# EAGLE schematic AquaLEd-drivers (EAGLE 8.4.1)
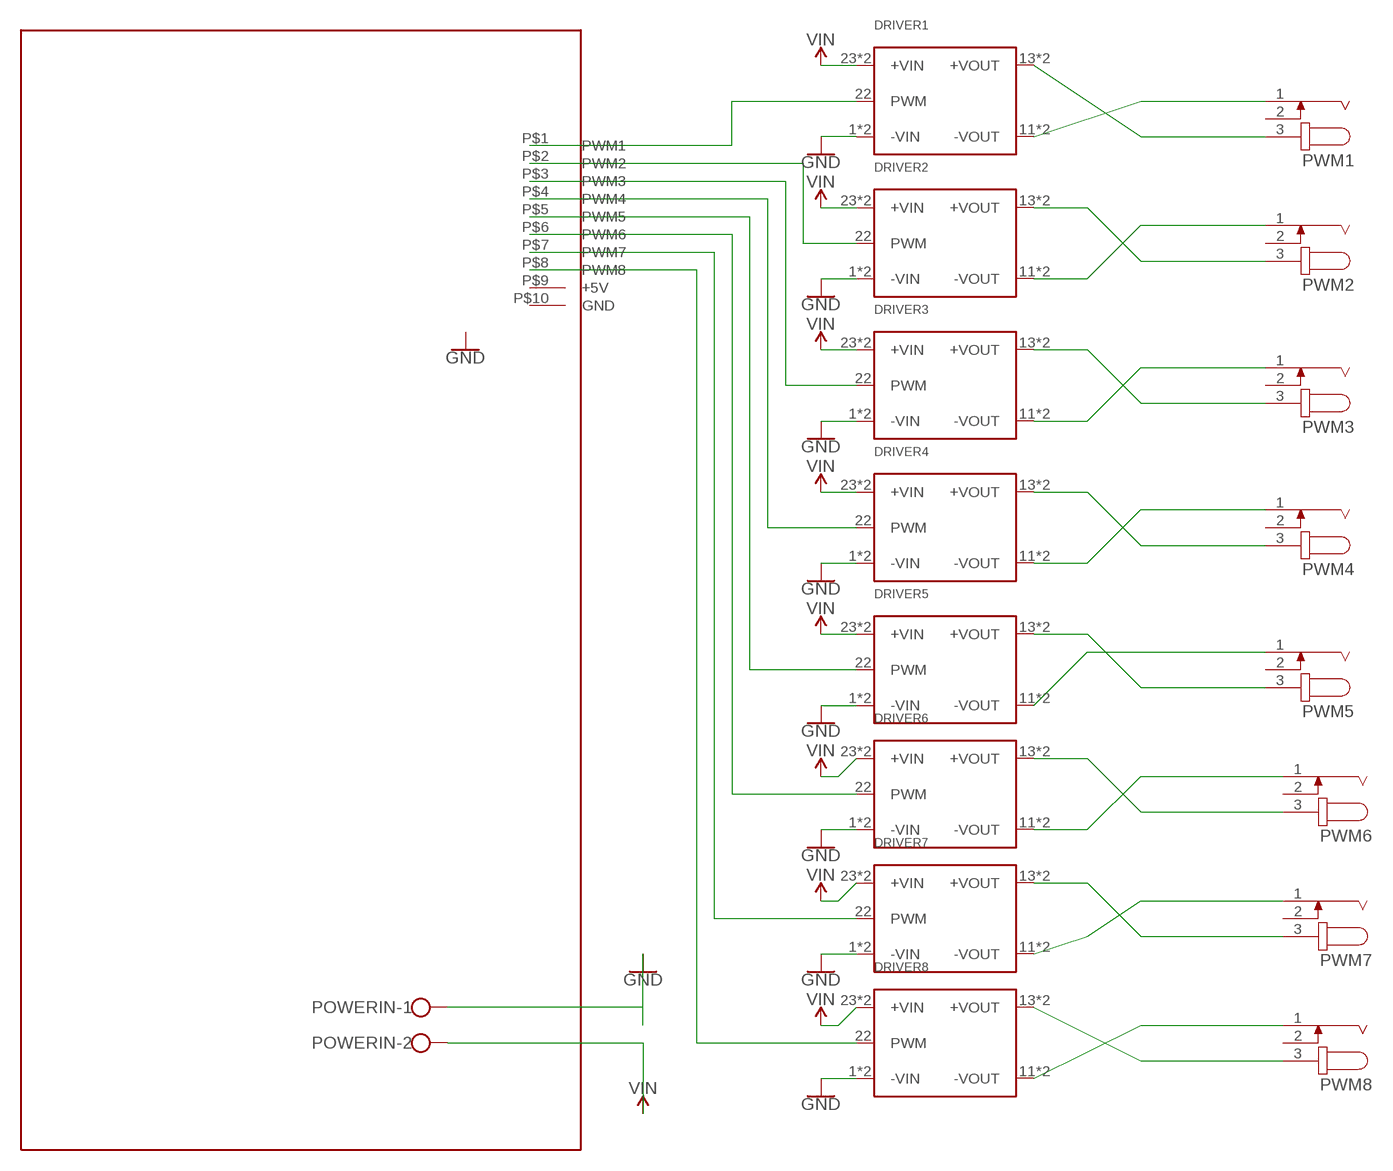
[diagram p0: schematic, sheet 1]

## Parts
DRIVER1  LDD-H  [LDD-H]
DRIVER2  LDD-H  [LDD-H]
DRIVER3  LDD-H  [LDD-H]
DRIVER4  LDD-H  [LDD-H]
DRIVER5  LDD-H  [LDD-H]
DRIVER6  LDD-H  [LDD-H]
DRIVER7  LDD-H  [LDD-H]
DRIVER8  LDD-H  [LDD-H]
POWERIN  W237-102  [W237-102]
PWM1  JACK-PLUG1  [SPC4078]
PWM2  JACK-PLUG1  [SPC4078]
PWM3  JACK-PLUG1  [SPC4078]
PWM4  JACK-PLUG1  [SPC4078]
PWM5  JACK-PLUG1  [SPC4078]
PWM6  JACK-PLUG1  [SPC4078]
PWM7  JACK-PLUG1  [SPC4078]
PWM8  JACK-PLUG1  [SPC4078]
U$29  PCB  [PCB]

## Nets
GND [power]: DRIVER1.1(-VIN) DRIVER1.2(-VIN) DRIVER2.1(-VIN) DRIVER2.2(-VIN) DRIVER3.1(-VIN) DRIVER3.2(-VIN) DRIVER4.1(-VIN) DRIVER4.2(-VIN) DRIVER5.1(-VIN) DRIVER5.2(-VIN) DRIVER6.1(-VIN) DRIVER6.2(-VIN) DRIVER7.1(-VIN) DRIVER7.2(-VIN) DRIVER8.1(-VIN) DRIVER8.2(-VIN) POWERIN.1
N$1: DRIVER1.22(PWM) U$29.P$1(PWM1)
N$2 [powerpwm]: DRIVER8.11(-VOUT) DRIVER8.12(-VOUT) PWM8.1
N$3 [powerpwm]: DRIVER8.13(+VOUT) DRIVER8.14(+VOUT) PWM8.3
N$4 [powerpwm]: DRIVER7.11(-VOUT) DRIVER7.12(-VOUT) PWM7.1
N$5 [powerpwm]: DRIVER7.13(+VOUT) DRIVER7.14(+VOUT) PWM7.3
N$6 [powerpwm]: DRIVER6.11(-VOUT) DRIVER6.12(-VOUT) PWM6.1
N$7 [powerpwm]: DRIVER6.13(+VOUT) DRIVER6.14(+VOUT) PWM6.3
N$8 [powerpwm]: DRIVER5.11(-VOUT) DRIVER5.12(-VOUT) PWM5.1
N$9 [powerpwm]: DRIVER5.13(+VOUT) DRIVER5.14(+VOUT) PWM5.3
N$10 [powerpwm]: DRIVER4.11(-VOUT) DRIVER4.12(-VOUT) PWM4.1
N$11 [powerpwm]: DRIVER4.13(+VOUT) DRIVER4.14(+VOUT) PWM4.3
N$12 [powerpwm]: DRIVER3.11(-VOUT) DRIVER3.12(-VOUT) PWM3.1
N$13 [powerpwm]: DRIVER3.13(+VOUT) DRIVER3.14(+VOUT) PWM3.3
N$14 [powerpwm]: DRIVER2.11(-VOUT) DRIVER2.12(-VOUT) PWM2.1
N$15 [powerpwm]: DRIVER2.13(+VOUT) DRIVER2.14(+VOUT) PWM2.3
N$16 [powerpwm]: DRIVER1.11(-VOUT) DRIVER1.12(-VOUT) PWM1.1
N$17 [powerpwm]: DRIVER1.13(+VOUT) DRIVER1.14(+VOUT) PWM1.3
N$18: DRIVER2.22(PWM) U$29.P$2(PWM2)
N$19: DRIVER3.22(PWM) U$29.P$3(PWM3)
N$20: DRIVER4.22(PWM) U$29.P$4(PWM4)
N$21: DRIVER5.22(PWM) U$29.P$5(PWM5)
N$22: DRIVER6.22(PWM) U$29.P$6(PWM6)
N$23: DRIVER7.22(PWM) U$29.P$7(PWM7)
N$24: DRIVER8.22(PWM) U$29.P$8(PWM8)
VIN [powerin]: DRIVER1.23(+VIN) DRIVER1.24(+VIN) DRIVER2.23(+VIN) DRIVER2.24(+VIN) DRIVER3.23(+VIN) DRIVER3.24(+VIN) DRIVER4.23(+VIN) DRIVER4.24(+VIN) DRIVER5.23(+VIN) DRIVER5.24(+VIN) DRIVER6.23(+VIN) DRIVER6.24(+VIN) DRIVER7.23(+VIN) DRIVER7.24(+VIN) DRIVER8.23(+VIN) DRIVER8.24(+VIN) POWERIN.2
Unconnected: PWM1.2 PWM2.2 PWM3.2 PWM4.2 PWM5.2 PWM6.2 PWM7.2 PWM8.2

## Power pins joined to a net without a drawn wire
+5V: U$29.P$9(+5V)
GND: U$29.P$10(GND)

## Library data of the parts
DRIVER1-DRIVER8 = meanwell_dcdc_v8:LDD-H: LDD-H Constant Current: 300 - 1000mA Vin : 9 - 56V Vout: 2 - 52V Cout: 300= 300mA 350= 350mA 500= 500mA 600= 600mA 700= 700mA 1000= 1000mA PWM Frequency: 100Hz - 1KHz (5V / 1mA)
POWERIN = con-wago-500:W237-102: WAGO SCREW CLAMP; MPN: 237-102; OC_FARNELL: unknown; OC_NEWARK: 70K9898
PWM1-PWM8 = con-jack:JACK-PLUG: DC POWER JACK Power Jack, DC, Right Angle, Through Hole, Rated 5A at 16VDC, PC Terminals Distributor: Farnell (www.Farnell.de) Drawing: 84N1161.pdf / 84N1162.pdf Manufacturer: SPC Technology (www.spctechnology.com) Type: SPC4077 / SPC 4078
U$29 = aqualed:PCB

## Net classes
0 default: width 0.406 mm
1 powerin: width 2 mm
2 powerpwm: width 1.5 mm, clearance 0.6 mm
3 power: width 0.8 mm, clearance 0.6 mm